# EAGLE schematic payload-schematic (EAGLE 9.6.2)
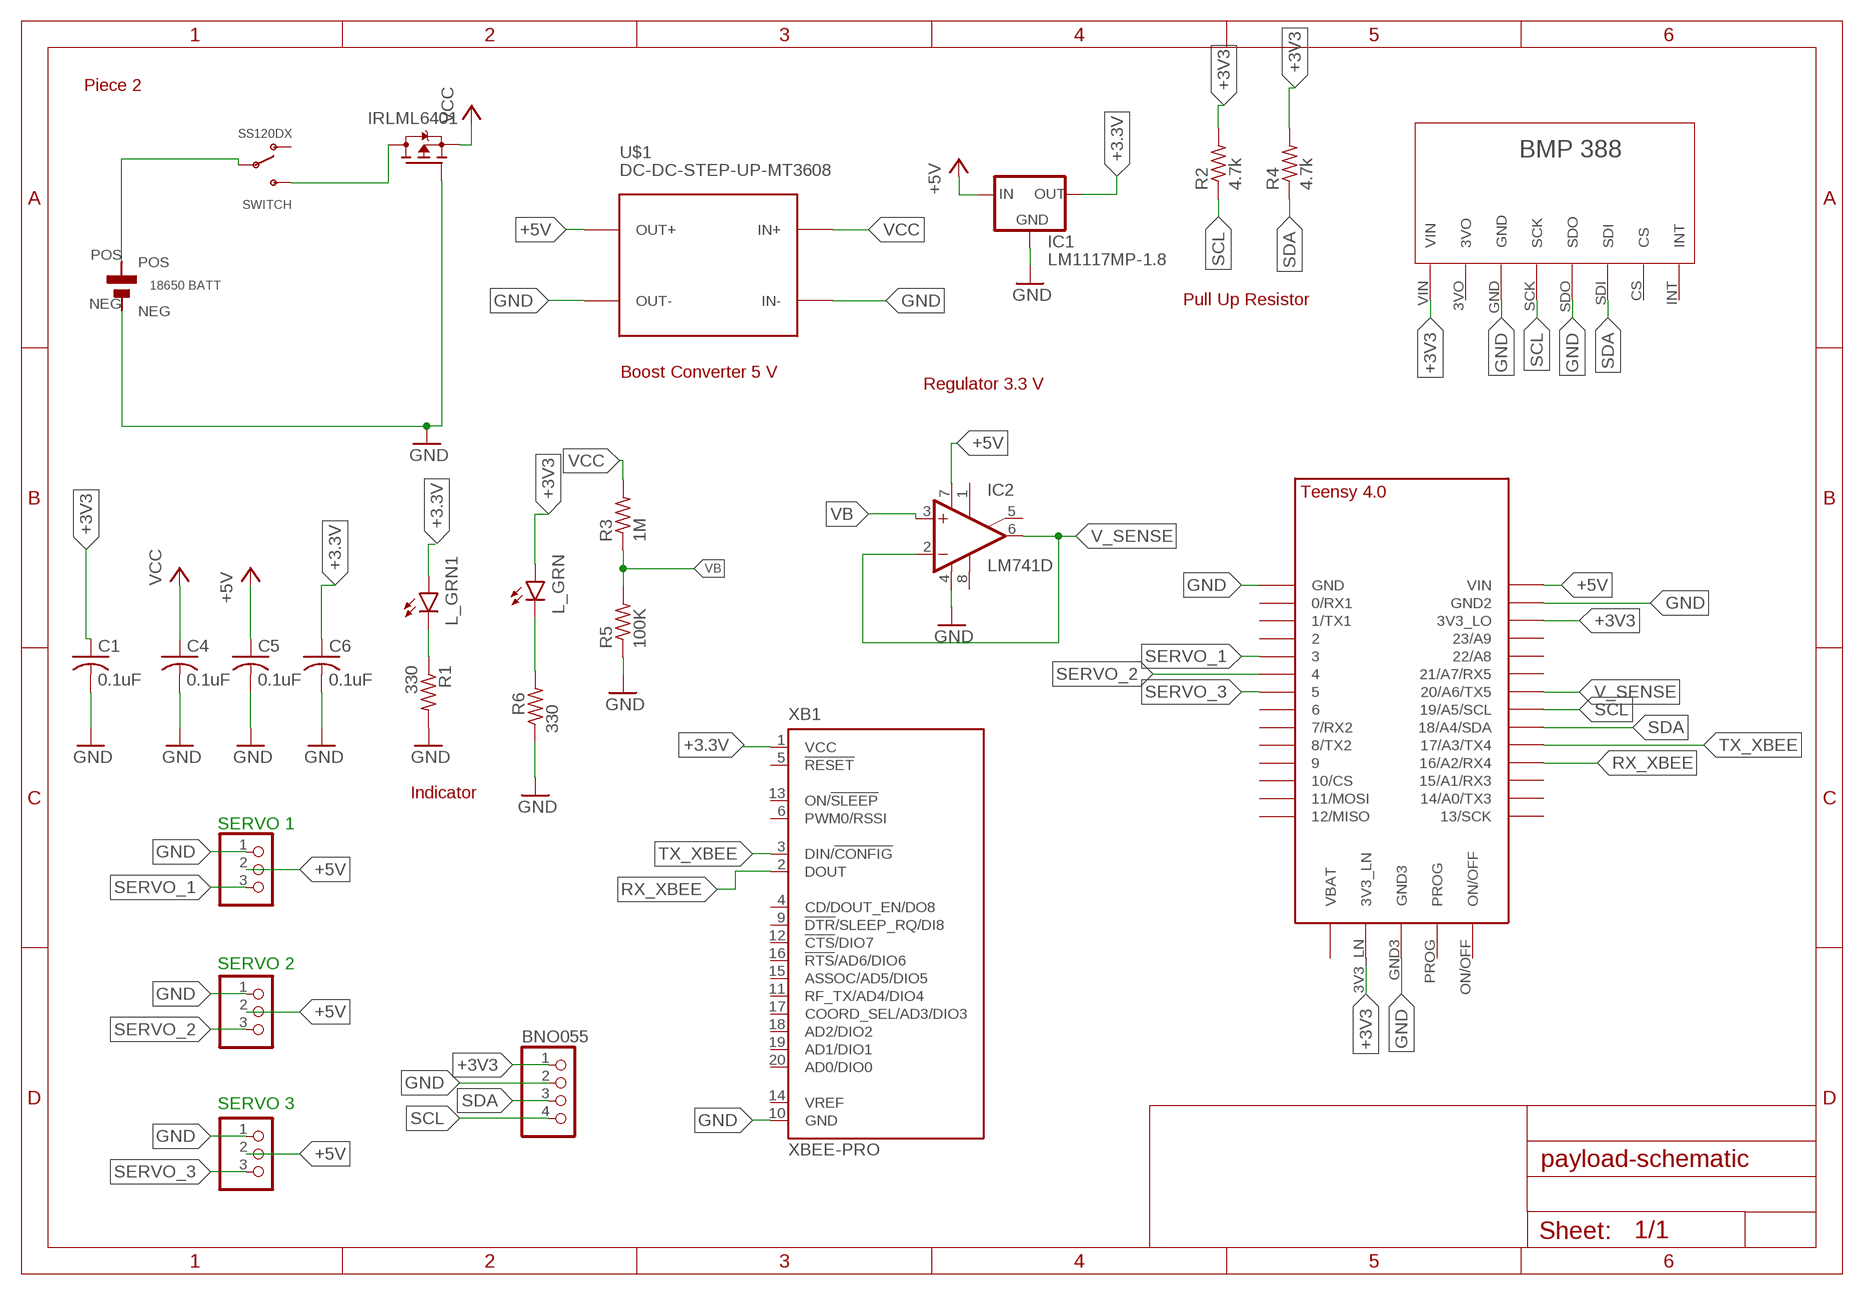
[diagram p0: schematic, sheet 1]

## Parts
BNO055  PINHD-1X4  [1X04]
C1  0.1uF  C-USC0805  [C0805]
C4  0.1uF  C-USC0805  [C0805]
C5  0.1uF  C-USC0805  [C0805]
C6  0.1uF  C-USC0805  [C0805]
IC1  LM1117MP-1.8  [SOT223]
IC2  LM741D  [SO08]
IRLML6401  MOSFET-PWIDE  [SOT23-WIDE]
L_GRN  LED1206  [LED-1206]
L_GRN1  LED1206  [LED-1206]
R1  330  R-US_M0805  [M0805]
R2  4.7k  R-US_M0805  [M0805]
R3  1M  R-US_M1206  [M1206]
R4  4.7k  R-US_M0805  [M0805]
R5  100K  R-US_M1206  [M1206]
R6  330  R-US_M0805  [M0805]
SERVO1  PINHD-1X3  [1X03]
SERVO2  PINHD-1X3  [1X03]
SERVO3  PINHD-1X3  [1X03]
SWITCH  SS120DX  [SS12D0X]
U$1  DC-DC-STEP-UP-MT3608  [DC-DC-STEP-UP-MT3608]
U$3  BMP388  [BMP388]
U$4  18650  [18650]
U$6  TEENSY_4.0  [TEENSY_4.0]
XB1  XBEE-PRO  [XBEE-PRO]

## Nets
+3.3V: C6.1 IC1.2(OUT) IC1.4(OUT) L_GRN1.A XB1.1(VCC)
+3V3: BNO055.1 C1.1 L_GRN.A R2.2 R4.2 U$3.VIN U$6.3V3_LN U$6.3V3_LO
+5V: C5.1 IC1.3(IN) IC2.7(V+) SERVO1.2 SERVO2.2 SERVO3.2 U$1.OUT+ U$6.VIN
GND: BNO055.2 C1.2 C4.2 C5.2 C6.2 IC1.1(GND) IC2.4(V-) IRLML6401.1(G) R1.2 R5.1 R6.1 SERVO1.1 SERVO2.1 SERVO3.1 U$1.IN- U$1.OUT- U$3.GND U$3.SDO U$4.NEG U$6.GND U$6.GND2 U$6.GND3 XB1.10(GND)
N$1: SWITCH.2 U$4.POS
N$2: L_GRN.C R6.2
N$3: IRLML6401.3(D) SWITCH.3
N$4: L_GRN1.C R1.1
RX_XBEE: U$6.16/A2(16/A2/RX4) XB1.2(DOUT)
SCL: BNO055.4 R2.1 U$3.SCK U$6.19/A5/SCL
SDA: BNO055.3 R4.1 U$3.SDI U$6.18/A4/SDA
SERVO_1: SERVO1.3 U$6.3/CANTX
SERVO_2: SERVO2.3 U$6.4/CANRX
SERVO_3: SERVO3.3 U$6.5
TX_XBEE: U$6.17/A3(17/A3/TX4) XB1.3(DIN/!CONFIG)
V_SENSE: IC2.2(-IN) IC2.6(OUT) U$6.20/A6(20/A6/TX5)
VB: IC2.3(+IN) R3.1 R5.2
VCC: C4.1 IRLML6401.2(S) R3.2 U$1.IN+
Unconnected: IC2.1(ON1) IC2.5(ON2) IC2.8(OPT) SWITCH.1 U$3.3VO U$3.CS U$3.INT U$6.0/RX(0/RX1) U$6.1/TX(1/TX1) U$6.2 U$6.6 U$6.7(7/RX2) U$6.8(8/TX2) U$6.9/CS U$6.10/CS U$6.11/MOSI U$6.12/MISO U$6.13/SCK U$6.14/A0(14/A0/TX3) U$6.15/A1(15/A1/RX3) U$6.21/A7(21/A7/RX5) U$6.22/A8 U$6.23/A9 U$6.ON/OFF U$6.PROG U$6.VBAT\(VBAT) XB1.4(CD/DOUT_EN/DO8) XB1.5(!RESET) XB1.6(PWM0/RSSI) XB1.9(!DTR!/SLEEP_RQ/DI8) XB1.11(RF_TX/AD4/DIO4) XB1.12(!CTS!/DIO7) XB1.13(ON/!SLEEP) XB1.14(VREF) XB1.15(ASSOC/AD5/DIO5) XB1.16(!RTS!/AD6/DIO6) XB1.17(COORD_SEL/AD3/DIO3) XB1.18(AD2/DIO2) XB1.19(AD1/DIO1) XB1.20(AD0/DIO0)

## Notes on the sheet
- Piece 2
- Pull Up Resistor
- Boost Converter 5 V
- Regulator 3.3 V
- Indicator
- SERVO 1
- SERVO 2
- SERVO 3

## Library data of the parts
BNO055 = pinhead:PINHD-1X4: PIN HEADER
C1 C4-C6 = rcl:C-US: CAPACITOR, American symbol; SPICEPREFIX: C
IC1 = lm1117_10:LM1117?-*: 800mA Low-Dropout Linear Regulator Source: http://www.ti.com/lit/ds/symlink/lm1117-n.pdf; MF: Texas Instruments; MPN: LM1117MP-1.8; OC_FARNELL: 1469053; OC_NEWARK: 41K3467
IC2 = linear:*741: OP AMP
IRLML6401 = microbuilder:MOSFET-P: P-Channel Mosfet LEGEND VDS: Voltage Drain-Source ID: Drain Current RDS(ON): Drain-Source On-State Resistance VGS(TH): Gate-Source Threshold Voltage CISS: Drain-Source Input Capacitance SOT-23 Name VDS ID RDS(ON) VGS(TH) CISS Order Number IRLML5103 30V 760mA 600 mOhm -- 75pF @ 25V Digikey: IRLML5103PBFCT-ND IRLML6401 12V 4.3A 50 mOhm 950mV @ 250µA 830pF @ 10V Digikey: IRLML6401PBFTR-ND NTR0202PL 20V 400mA 800 mOhm 2.3V @ 250uA 70pF @ 5V Digikey: NTR0202PLT1GOSTR-ND NTR4101PT1G 20V 1.8A 85 mOhm 1.2V @ 250uA 675pF @ 10V Digikey: NTR4101PT1GOSCT-ND DMP2004K 20V 600mA 900 mOhm 1V @ 250uA 175pF @ 16V Digikey: DMP2004KDICT-ND PMV65XP 20V 3.9A 76 mOhm 950mV @ 1mA 725pF @ 20V Digikey: 568-2358-2-ND TO-252 Name VDS ID RDS(ON) VGS(TH) CISS Order Number AOD417 30V 25A 34 mOhm 3V @ 250µA 920pF @ 15V Digikey: 785-1106-2-ND
L_GRN L_GRN1 = SparkFun-LED:LED: LED (Generic) Standard schematic elements and footprints for 5mm, 3mm, 1206, and 0603 sized LEDs. Generic LEDs with no color specified.
R1-R6 = rcl:R-US_: RESISTOR, American symbol; SPICEPREFIX: R
SERVO1-SERVO3 = pinhead:PINHD-1X3: PIN HEADER
SWITCH = mario:SS120DX
U$1 = diy-modules:DC-DC-STEP-UP-MT3608: DC/DC Step-Up Regulator based on MT3608 chip MT3608 datasheet available here: https://www.olimex.com/Products/Breadboarding/BB-PWR-3608/resources/MT3608.pdf Click here to find device on ebay.com <http://www.ebay.com/sch/mt3608+module>
U$3 = mario:BMP388
U$4 = mario:18650
U$6 = TEENSY 4.0:TEENSY_4.0
XB1 = maxstream:XBEE: XBee (TM) /XBee-PRO(TM) OEM RF Modules Source: MaxStream, Inc. xbee_productmanual.pdf; MPN: XBP24-AWI-001; OC_FARNELL: 1337916; OC_NEWARK: 42M2667